# Altium schematic sheet DRV8303.SchDoc
size A3; DocumentNumber: 3; SheetNumber: 3; SheetTotal: 4
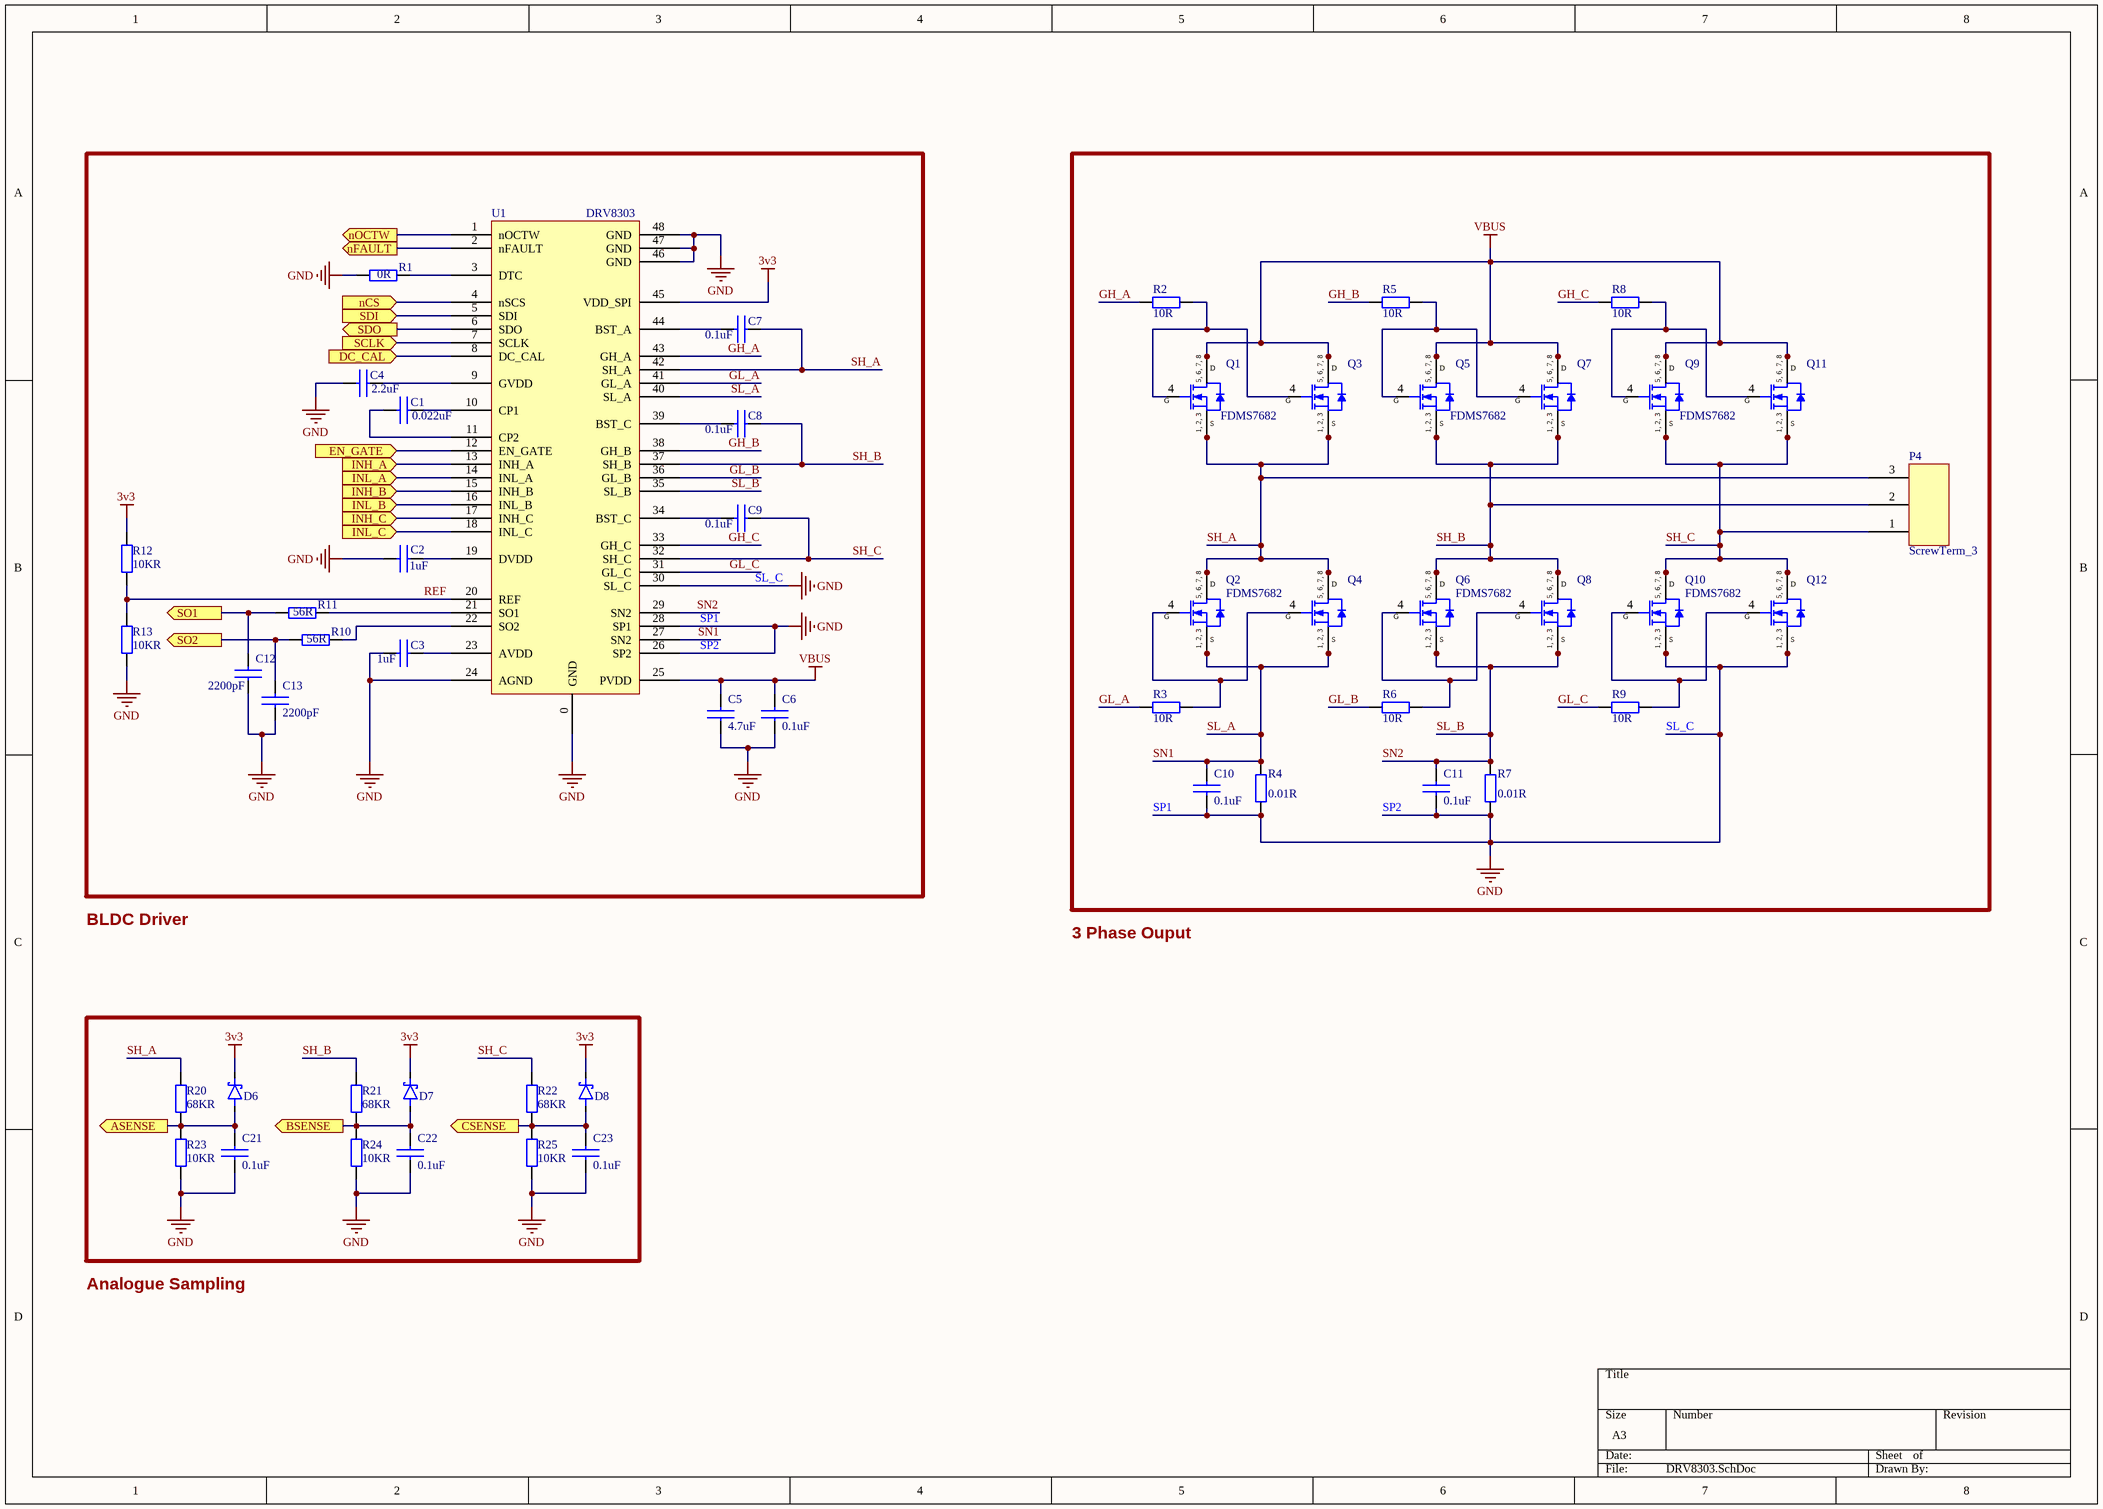
[diagram p0: DRV8303.SchDoc]

## Parts
C1  0.022uF  [RESC0603(1608)_N]
C2  1uF  [RESC0603(1608)_N]
C3  1uF  [RESC0603(1608)_N]
C4  2.2uF  [RESC0603(1608)_N]
C5  4.7uF  [RESC0603(1608)_N]
C6  0.1uF  [RESC0603(1608)_N]
C7  0.1uF  [RESC0603(1608)_N]
C8  0.1uF  [RESC0603(1608)_N]
C9  0.1uF  [RESC0603(1608)_N]
C10  0.1uF  [RESC0603(1608)_N]
C11  0.1uF  [RESC0603(1608)_N]
C12  2200pF  [RESC0603(1608)_N]
C13  2200pF  [RESC0603(1608)_N]
C21  0.1uF  [RESC0603(1608)_N]
C22  0.1uF  [RESC0603(1608)_N]
C23  0.1uF  [RESC0603(1608)_N]
D6  Diode_schottky  [SOD523]  (value not drawn)
D7  Diode_schottky  [SOD523]  (value not drawn)
D8  Diode_schottky  [SOD523]  (value not drawn)
P4  ScrewTerm_3  [ScrewTerm_3]
Q1  FDMS7682  [PQFN8_5x6]
Q2  FDMS7682  [PQFN8_5x6]
Q3  FDMS7682  [PQFN8_5x6]  (value not drawn)
Q4  FDMS7682  [PQFN8_5x6]  (value not drawn)
Q5  FDMS7682  [PQFN8_5x6]
Q6  FDMS7682  [PQFN8_5x6]
Q7  FDMS7682  [PQFN8_5x6]  (value not drawn)
Q8  FDMS7682  [PQFN8_5x6]  (value not drawn)
Q9  FDMS7682  [PQFN8_5x6]
Q10  FDMS7682  [PQFN8_5x6]
Q11  FDMS7682  [PQFN8_5x6]  (value not drawn)
Q12  FDMS7682  [PQFN8_5x6]  (value not drawn)
R1  0R  [RESC0603(1608)_N]
R2  10R  [RESC0603(1608)_N]
R3  10R  [RESC0603(1608)_N]
R4  0.01R  [RESC1206(3216)_M]
R5  10R  [RESC0603(1608)_N]
R6  10R  [RESC0603(1608)_N]
R7  0.01R  [RESC1206(3216)_M]
R8  10R  [RESC0603(1608)_N]
R9  10R  [RESC0603(1608)_N]
R10  56R  [RESC0603(1608)_N]
R11  56R  [RESC0603(1608)_N]
R12  10KR  [RESC0603(1608)_N]
R13  10KR  [RESC0603(1608)_N]
R20  68KR  [RESC0603(1608)_N]
R21  68KR  [RESC0603(1608)_N]
R22  68KR  [RESC0603(1608)_N]
R23  10KR  [RESC0603(1608)_N]
R24  10KR  [RESC0603(1608)_N]
R25  10KR  [RESC0603(1608)_N]
U1  DRV8303  [HSSOP48]

## Ports
ASENSE (out), BSENSE (out), CSENSE (out), DC_CAL (in), EN_GATE (in), INH_A (in), INH_B (in), INH_C (in), INL_A (in), INL_B (in), INL_C (in), nCS (in), nFAULT (out), nOCTW (out), SCLK (in), SDI (in), SDO (out), SO1 (out), SO2 (out)

## Nets
3v3: D6.1 D7.1 D8.1 R12.2 U1.45(VDD_SPI)
GND: C2.1 C3.1 C4.1 C5.2 C6.2 C10.2 C11.2 C12.2 C13.2 C21.2 C22.2 C23.2 Q10.1(S) Q10.2(S) Q10.3(S) Q12.1(S) Q12.2(S) Q12.3(S) R1.1 R4.2 R7.2 R13.1 R23.1 R24.1 R25.1 U1.0(GND) U1.24(AGND) U1.26(SP2) U1.28(SP1) U1.30(SL_C) U1.46(GND) U1.47(GND) U1.48(GND)
VBUS: C5.1 C6.1 Q1.0(D) Q1.5(D) Q1.6(D) Q1.7(D) Q1.8(D) Q3.0(D) Q3.5(D) Q3.6(D) Q3.7(D) Q3.8(D) Q5.0(D) Q5.5(D) Q5.6(D) Q5.7(D) Q5.8(D) Q7.0(D) Q7.5(D) Q7.6(D) Q7.7(D) Q7.8(D) Q9.0(D) Q9.5(D) Q9.6(D) Q9.7(D) Q9.8(D) Q11.0(D) Q11.5(D) Q11.6(D) Q11.7(D) Q11.8(D) U1.25(PVDD)
ASENSE: C21.1 D6.2 R20.1 R23.2 ; port ASENSE
BSENSE: C22.1 D7.2 R21.1 R24.2 ; port BSENSE
CSENSE: C23.1 D8.2 R22.1 R25.2 ; port CSENSE
DC_CAL: U1.8(DC_CAL) ; port DC_CAL
EN_GATE: U1.12(EN_GATE) ; port EN_GATE
GH_A: R2.1 U1.43(GH_A)
GH_B: R5.1 U1.38(GH_B)
GH_C: R8.1 U1.33(GH_C)
GL_A: R3.1 U1.41(GL_A)
GL_B: R6.1 U1.36(GL_B)
GL_C: R9.1 U1.31(GL_C)
INH_A: U1.13(INH_A) ; port INH_A
INH_B: U1.15(INH_B) ; port INH_B
INH_C: U1.17(INH_C) ; port INH_C
INL_A: U1.14(INL_A) ; port INL_A
INL_B: U1.16(INL_B) ; port INL_B
INL_C: U1.18(INL_C) ; port INL_C
nCS: U1.4(nSCS) ; port nCS
nFAULT: U1.2(nFAULT) ; port nFAULT
nOCTW: U1.1(nOCTW) ; port nOCTW
REF: R12.1 R13.2 U1.20(REF)
SCLK: U1.7(SCLK) ; port SCLK
SDI: U1.5(SDI) ; port SDI
SDO: U1.6(SDO) ; port SDO
SH_A: C7.2 P4.3 Q1.1(S) Q1.2(S) Q1.3(S) Q2.0(D) Q2.5(D) Q2.6(D) Q2.7(D) Q2.8(D) Q3.1(S) Q3.2(S) Q3.3(S) Q4.0(D) Q4.5(D) Q4.6(D) Q4.7(D) Q4.8(D) R20.2 U1.42(SH_A)
SH_B: C8.2 P4.2 Q5.1(S) Q5.2(S) Q5.3(S) Q6.0(D) Q6.5(D) Q6.6(D) Q6.7(D) Q6.8(D) Q7.1(S) Q7.2(S) Q7.3(S) Q8.0(D) Q8.5(D) Q8.6(D) Q8.7(D) Q8.8(D) R21.2 U1.37(SH_B)
SH_C: C9.2 P4.1 Q9.1(S) Q9.2(S) Q9.3(S) Q10.0(D) Q10.5(D) Q10.6(D) Q10.7(D) Q10.8(D) Q11.1(S) Q11.2(S) Q11.3(S) Q12.0(D) Q12.5(D) Q12.6(D) Q12.7(D) Q12.8(D) R22.2 U1.32(SH_C)
SL_A: C10.1 Q2.1(S) Q2.2(S) Q2.3(S) Q4.1(S) Q4.2(S) Q4.3(S) R4.1 U1.27(SN2) U1.40(SL_A)  [also labelled SN1]
SL_B: C11.1 Q6.1(S) Q6.2(S) Q6.3(S) Q8.1(S) Q8.2(S) Q8.3(S) R7.1 U1.29(SN2) U1.35(SL_B)  [also labelled SN2]
SO1: C12.1 R11.1 ; port SO1
SO2: C13.1 R10.1 ; port SO2
NetC1_1: C1.1 U1.11(CP2)
NetC1_2: C1.2 U1.10(CP1)
NetC2_2: C2.2 U1.19(DVDD)
NetC3_2: C3.2 U1.23(AVDD)
NetC4_2: C4.2 U1.9(GVDD)
NetC7_1: C7.1 U1.44(BST_A)
NetC8_1: C8.1 U1.39(BST_C)
NetC9_1: C9.1 U1.34(BST_C)
NetQ1_4: Q1.4(G) Q3.4(G) R2.2
NetQ2_4: Q2.4(G) Q4.4(G) R3.2
NetQ5_4: Q5.4(G) Q7.4(G) R5.2
NetQ6_4: Q6.4(G) Q8.4(G) R6.2
NetQ9_4: Q9.4(G) Q11.4(G) R8.2
NetQ10_4: Q10.4(G) Q12.4(G) R9.2
NetR1_2: R1.2 U1.3(DTC)
NetR10_2: R10.2 U1.22(SO2)
NetR11_2: R11.2 U1.21(SO1)

## Notes on the sheet
- SL_C
- SP1
- SP2
- (near R9) SL_C
- (near C10) SP1
- (near C11) SP2
- BLDC Driver
- 3 Phase Ouput
- Analogue Sampling
- (in symbol FDMS7682) 5, 6, 7, 8; 1, 2, 3

## Library data of the parts
C1-C13 C21-C23 = Capacitor: Non polarized capacitor; Manufacturer: *; Mounting Technology: Surface Mount; PartNumber: *; Digikey Part Number: *
R1-R13 R20-R25 = Resistor: ComponentLink1Description: Land patterns; ComponentLink1URL: https://www.vishay.com/docs/60119/landpatterns.pdf; PartNumber: *; Manufacturer: *; Mounting Technology: Surface Mount; Digikey Part Number: *; ComponentLink2Description: 1k digikey; ComponentLink2URL: https://www.digikey.com.au/product-detail/en/yageo/RC0603JR-071KL/311-1.0KGRCT-ND/729624; ComponentLink3Description: shunt digikey; ComponentLink3URL: https://www.digikey.com.au/product-detail/en/yageo/PF1206FRF070R02L/311-0.02AJCT-ND/2178365
  R4 R7: ClassName: pour_over
P4 = ScrewTerm_3: ClassName: pour_over
Q1-Q12 = FDMS7682: ClassName: pour_over